# Altium schematic sheet circuitMain.SchDoc
size 420 x 297 mm; Address1: Address1; Address2: Address2; Address3: Address3; Address4: Address4; SheetNumber: 1; Scale: 1:1; Разраб.: Лепотенко А.С.; Обозначение документа: ЛАС.425683.001Э3; Т.контр.: авав; Перв. применение: ЛАС.425683.001Э3; Наименование изделия 1: Система захвата движения; Наименование изделия 2: Схема электрическая; Наименование изделия 3: принципиальная; Нач. отд.: Нач. отд.
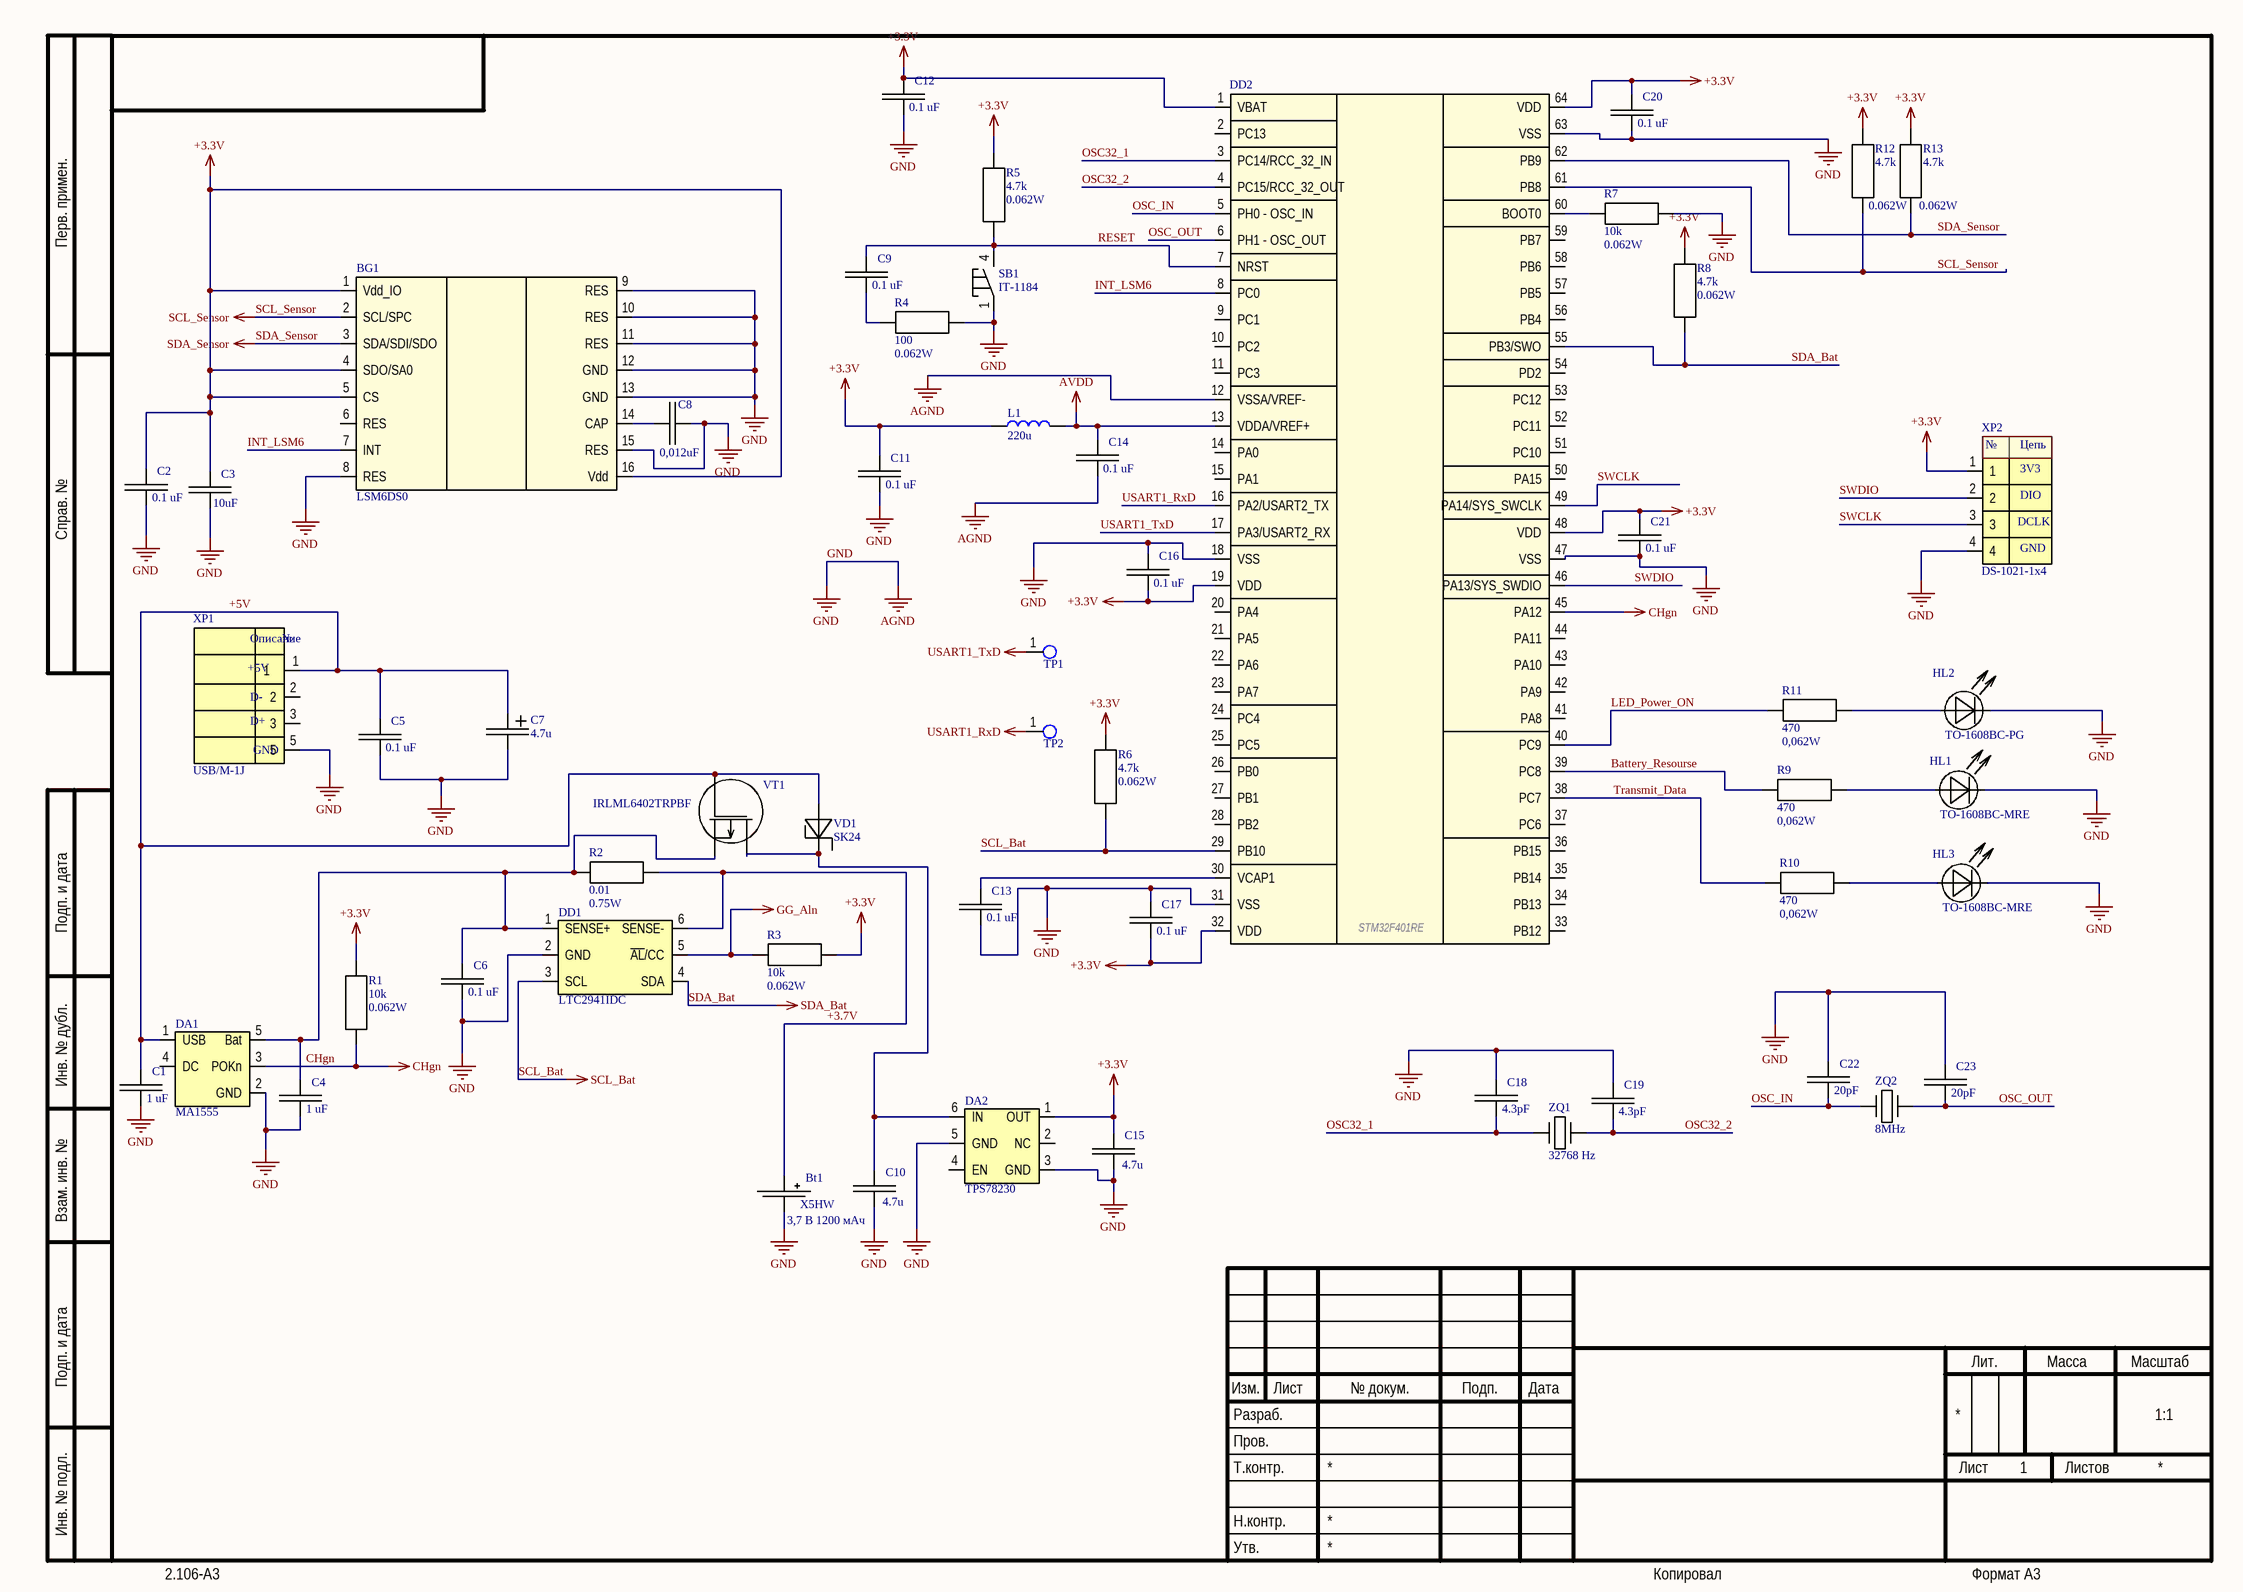
[diagram p0: circuitMain.SchDoc]

## Parts
BG1  LSM6DS0  [LGA-16]
Bt1  X5HW  value 3,7 В 1200 мАч  [X5HW]
C1  1 uF  [CAP0402_min]
C2  0.1 uF  [CAP0402_min]
C3  10uF  [CAP0402_min]
C4  1 uF  [CAP0402_min]
C5  0.1 uF  [CAP0402_min]
C6  0.1 uF  [CAP0402_min]
C7  4.7u  [Capasitor Tantal TypeA MIN]
C8  0,012uF  [CAP0402_min]
C9  0.1 uF  [CAP0402_min]
C10  4.7u  [CAP0402_min]
C11  0.1 uF  [CAP0402_min]
C12  0.1 uF  [CAP0402_min]
C13  0.1 uF  [CAP0402_min]
C14  0.1 uF  [CAP0402_min]
C15  4.7u  [CAP0402_min]
C16  0.1 uF  [CAP0402_min]
C17  0.1 uF  [CAP0402_min]
C18  4.3pF  [CAP0402_min]
C19  4.3pF  [CAP0402_min]
C20  0.1 uF  [CAP0402_min]
C21  0.1 uF  [CAP0402_min]
C22  20pF  [CAP0402_min]
C23  20pF  [CAP0402_min]
DA1  MA1555  [SOT23-5]
DA2  TPS78230  [WSON-6]
DD1  LTC2941IDC  [DFN-6]
DD2  STM32F401RE  [LQFP-64]
HL1  TO-1608BC-MRE  [LED1206]
HL2  TO-1608BC-PG  [LED1206]
HL3  TO-1608BC-MRE  [LED1206]
L1  220u  [LQG15HN15NJ]
R1  Power: 0.062W  [0402]  (hidden comment: 10k)
R2  Power: 0.75W  [1206]  (hidden comment: 0.01)
R3  Power: 0.062W  [0402]  (hidden comment: 10k)
R4  Power: 0.062W  [0402]  (hidden comment: 100)
R5  Power: 0.062W  [0402]  (hidden comment: 4.7k)
R6  Power: 0.062W  [0402]  (hidden comment: 4.7k)
R7  Power: 0.062W  [0402]  (hidden comment: 10k)
R8  Power: 0.062W  [0402]  (hidden comment: 4.7k)
R9  Power: 0,062W  [0402]  (hidden comment: 470)
R10  Power: 0,062W  [0402]  (hidden comment: 470)
R11  Power: 0,062W  [0402]  (hidden comment: 470)
R12  Power: 0.062W  [0402]  (hidden comment: 4.7k)
R13  Power: 0.062W  [0402]  (hidden comment: 4.7k)
SB1  IT-1184  [IT-1184]
TP1  TP  [TP_Hole]  (value not drawn)
TP2  TP  [TP_Hole]  (value not drawn)
VD1  SK24  [DO-214(SMB)]
VT1  IRLML6402TRPBF  [SOT23-3]
XP1  USB/M-1J  [USB/M-1J]
XP2  DS-1021-1x4  [Connector_STKLink]
ZQ1  32768 Hz  [KX-26]
ZQ2  8MHz  [SMD0503]

## Nets
+3.3V: BG1.1(Vdd_IO) BG1.4(SDO/SA0) BG1.5(CS) BG1.16(Vdd) C2.1 C3.1 C11.1 C12.1 C15.1 C16.2 C17.2 C20.1 C21.1 DA2.1(OUT) DD2.1(VBAT) DD2.19(VDD) DD2.32(VDD) DD2.48(VDD) DD2.64(VDD) L1.1 R1.2 R3.1 R5.2 R6.2 R8.2 R12.2 R13.2 XP2.1
AVDD: C14.1 DD2.13(VDDA/VREF+) L1.2
CHgn: DA1.3(POKn) DD2.45(PA12) R1.1
GG_Aln: DD1.5(~{AL}/CC) R3.2
GND: BG1.8(RES) BG1.9(RES) BG1.10(RES) BG1.11(RES) BG1.12(GND) BG1.13(GND) BG1.15(RES) Bt1.2 C1.2 C2.2 C3.2 C4.2 C5.2 C6.2 C7.2 C8.2 C10.2 C11.2 C12.2 C13.2 C14.2 C15.2 C16.1 C17.1 C18.1 C19.1 C20.2 C21.2 C22.1 C23.1 DA1.2(GND) DA2.3(GND) DA2.5(GND) DD1.2(GND) DD2.12(VSSA/VREF-) DD2.18(VSS) DD2.31(VSS) DD2.47(VSS) DD2.63(VSS) HL1.2 HL2.2 HL3.2 R4.1 R7.1 SB1.1 XP1.5 XP2.4  [also labelled AGND]
SCL_Bat: DD1.3(SCL) DD2.29(PB10) R6.1
SCL_Sensor: BG1.2(SCL/SPC) DD2.61(PB8) R12.1
SDA_Bat: DD1.4(SDA) DD2.55(PB3/SWO) R8.1
SDA_Sensor: BG1.3(SDA/SDI/SDO) DD2.62(PB9) R13.1
USART1_RxD: DD2.16(PA2/USART2_TX) TP2.1
USART1_TxD: DD2.17(PA3/USART2_RX) TP1.1
+3.7V: Bt1.1 DD1.6(SENSE-) R2.2
+5V: C1.1 C5.1 C7.1 DA1.1(USB) VD1.1 VT1.1(G) XP1.1
Battery_Resourse: DD2.39(PC8) R9.2
INT_LSM6: BG1.7(INT) DD2.8(PC0)
LED_Power_ON: DD2.40(PC9) R11.2
OSC32_1: C18.2 DD2.3(PC14/RCC_32_IN) ZQ1.1
OSC32_2: C19.2 DD2.4(PC15/RCC_32_OUT) ZQ1.3
OSC_IN: C22.2 DD2.5(PH0_-_OSC_IN) ZQ2.1
OSC_OUT: C23.2 DD2.6(PH1_-_OSC_OUT) ZQ2.3
RESET: C9.1 DD2.7(NRST) R5.1 SB1.4
SWCLK: DD2.49(PA14/SYS_SWCLK) XP2.3
SWDIO: DD2.46(PA13/SYS_SWDIO) XP2.2
Transmit_Data: DD2.38(PC7) R10.2
NetBG1_14: BG1.14(CAP) C8.1
NetC4_1: C4.1 C6.1 DA1.5(Bat) DD1.1(SENSE+) R2.1 VT1.2(Source)
NetC9_2: C9.2 R4.2
NetC10_1: C10.1 DA2.6(IN) VD1.2 VT1.3(D)
NetC13_1: C13.1 DD2.30(VCAP1)
NetDD2_60: DD2.60(BOOT0) R7.2
NetHL1_1: HL1.1 R9.1
NetHL2_1: HL2.1 R11.1
NetHL3_1: HL3.1 R10.1

Not connected (* = marked no-connect by the designer): BG1 6(RES); DA1 4(DC); DA2 2(NC) 4(EN); DD2 2(PC13) 9(PC1) 10(PC2) 11(PC3) 14(PA0) 15(PA1) 20(PA4) 21(PA5) 22(PA6) 23(PA7) 24(PC4) 25(PC5) 26(PB0) 27(PB1) 28(PB2) 33(PB12) 34(PB13) 35(PB14) 36(PB15) 37(PC6) 41(PA8) 42(PA9) 43(PA10) 44(PA11) 50(PA15) 51(PC10) 52(PC11) 53(PC12) 54(PD2) 56(PB4) 57(PB5) 58(PB6) 59(PB7); XP1 2 3

## Notes on the sheet
- Перв. примен.
- Справ. №
- Подп. и дата
- Инв. № дубл.
- Взам. инв. №
- Разраб.
- Изм.
- Лист
- № докум.
- Подп.
- Дата
- Лит.
- Масса
- Масштаб
- Пров.
- Т.контр.
- Листов
- Инв. № подл.
- Утв.
- Н.контр.
- 2.106-A3
- Копировал
- Формат А3
- (in symbol Connector_STKLink) №; Цепь; 3V3; DIO; DCLK; GND
- (in symbol USB-M-1J) Описание; №; +5V; D-; D+; GND

## Library data of the parts
BG1 = LSM6DS0: IMEMO; Manufacture: STMMicroElectronics; Value: 16g; Part Number: LSM6DS0; Package: LGA-16; Price: 4,5; Quantity: 10; ShoppingPlace: https://ru.aliexpress.com/store/product/Free-shipping-10PCS-LSM6DS0TR-LGA-16-LSM6DS0-new-chip-IC-best-quality/1749123_32483761173.html?aff_platform=link-c-tool&cpt=1531246783362&sk=ZjmAemm&aff_trace_key=8a7dd90f83b244d7b563d2b9fb293d25-1531246783362-08030-ZjmAemm&terminal_id=636778b2a25b45858895bbc6c5ce3b1a; Documentation: https://www.st.com/resource/en/datasheet/lsm6ds0.pdf
Bt1 = X5HW: Part Number: 2025; Manufacturer: china; Quantity: https://ru.aliexpress.com/item/3-7-1200-Lipo/32852574199.html?spm=a2g0v.search0604.3.181.2111fc08nULavV&ws_ab_test=searchweb0_0%2Csearchweb201602_3_10152_10151_10065_10344_10068_10342_10343_10340_10341_10696_10084_5722520_10083_5711520_10618_10307_10059_5722620_5722920_306_5722720_5722820_100031_5711420_10103_10624_10623_10622_10621_10620_10125%2Csearchweb201603_31%2CppcSwitch_5&algo_expid=a7204690-5c98-48fe-b8bb-b8922ec76835-26&algo_pvid=a7204690-5c98-48fe-b8bb-b8922ec76835&transAbTest=ae803_2&priceBeautifyAB=0; Package: smd; Price: 5; ShoppingPlace: https://ru.aliexpress.com/item/1Pcs-3-7V-800mAh-Battery-for-Drone-For-x5c-x5sw-x5-L15-RC-Quadcopter-Pro-Accessories/32853787962.html?spm=a2g0v.search0604.3.56.7e86fc08nuVnEH&ws_ab_test=searchweb0_0,searchweb201602_3_10846_10152_10065_10151_10344_10068_10342_10343_10340_10059_10341_10696_100031_10084_10083_10103_524_10618_10624_10307_10623_10622_10621_10620,searchweb201603_2,ppcSwitch_5&algo_expid=3f134381-0cd0-46b3-8018-4341e1aaa5ba-8&algo_pvid=3f134381-0cd0-46b3-8018-4341e1aaa5ba&transAbTest=ae803_2&priceBeautifyAB=0
C1 C4 = Capasitor: Part Number: GRM155R61A105KE15B; Manufacturer: Murata Manufacturing; Voltage: 10V; Value: 1 uF; Quantity: 50; Package: 0402; Price: 0,035; ShoppingPlace: https://www.ru-chipdip.by/product/grm155r61a105k
C2 C5 C6 C9 C11-C14 C16 C17 C20 C21 = Capasitor: Part Number: C1005X7R1H104KT000F; Manufacturer: TDK; Voltage: 50V; Value: 0.1 uF; Quantity: 50; Package: 0402; Price: 0,15; ShoppingPlace: http://belchip.by/product/?selected_product=33981
C3 = Capasitor: Part Number: GRM1535C1H100J; Manufacturer: Murata Manufacturing; Voltage: 50V; Value: 10uF; Quantity: 50; Package: 0402; Price: 0,02; ShoppingPlace: https://www.ru-chipdip.by/product/grm1535c1h100j
C7 = Capasitor Electrolit: Part Number: TECAP4.7/16VA10; Manufacturer: China; Power: 16V; Value: 4.7u; Price: 0.16; ShoppingPlace: https://www.ru-chipdip.by/product0/850917081; Package: Type A
C8 = Capasitor: Part Number: GRM155R71H123K; Manufacturer: Murata Manufacturing; Voltage: 50V; Value: 0,012uF; Quantity: 50; Package: 0402; Price: 0,02; ShoppingPlace: https://www.ru-chipdip.by/product/grm155r71h123k
C10 C15 = Capasitor: Part Number: GRM2165C1H4R7CD01D; Manufacturer: Murata Manufacturing; Voltage: 50V; Value: 4.7u; Quantity: 50; Package: 0402; Price: 0,035; ShoppingPlace: https://www.ru-chipdip.by/product/grm2165c1h4r7c
C18 C19 = Capasitor: Part Number: CL05C4R7BB5NNNC; Manufacturer: Samsung; Voltage: 50V; Value: 4.3pF; Quantity: 50; Package: 0402; Price: 0,15; ShoppingPlace: http://belchip.by/product/?selected_product=18863
C22 C23 = Capasitor: Part Number: CL05C220JB5NNNC; Manufacturer: Samsung; Voltage: 50V; Value: 20pF; Quantity: 50; Package: 0402; Price: 0,15; ShoppingPlace: http://belchip.by/product/?selected_product=18843
DA1 = MAX1555: Part Number: MAX1555EZK+T; Manufacturer: Maxim Integrated Products; Quantity: 1; Package: SOT-23-5; Price: 1; ShoppingPlace: http://belchip.by/product/?selected_product=06393
DA2 = TPS78230: Part Number: TSOT23-5; Manufacturer: Texas Instruments; Value: 3V; Quantity: 1; Package: SOT-23-6; Price: 1.58; ShoppingPlace: https://www.digikey.com/product-detail/en/texas-instruments/TPS78230DDCR/296-24372-2-ND/2051745
DD1 = LTC2941IDC: Manufacturer: RoHS Compliant; Value: 5V; Part Number: LTC2941IDC; Quantity: 1; Package: 6-DFN; Price: 1.58; ShoppingPlace: https://www.digikey.com/product-detail/en/linear-technology-analog-devices/LTC1754ES6-5-TRMPBF/LTC1754ES6-5-TRMPBFTR-ND/962607
DD2 = STM32F401RE: Manufacturer: STM MicroElectronics; Value: *; Documentation: http://www.keil.com/dd/docs/datashts/st/stm32f4xx/dm00102166.pdf; Price: 12; ShoppingPlace: *; Quantity: 1; Part Number: STM32F401RE
HL1 HL3 = LED: Manufacturer: Taiwan Oasis Technology Co; Value: RED; Part Number: TO-1608BC-MRE; Price: 0.03; Package: 1608; Quantity: 10; Shopping Place: https://www.ru-chipdip.by/product/to-1608bc-mre
HL2 = LED: Manufacturer: Taiwan Oasis Technology; Value: GREEN; Part Number: TO-1608BC-PG; Price: 0.03; Package: 1608; Quantity: 10; Shopping Place: https://www.ru-chipdip.by/product/to-1608bc-pg
L1 = Inductor: Part Number: CM453232-221KL; Manufacturer: Bourns; Value: 220u; ShoppingPlace: https://www.ru-chipdip.by/product/cm453232-221kl; Price: 0.225; Package: 1812; Quantity: 2
R1 R3 R7 = Resistor: Manufacturer: Тайвань; Part Number: RC0402FR-0710KL; Quntity: 50; Price: 0,015; Package: 0402; Value: 10k
R2 = Resistor: Manufacturer: China; Part Number: 120600R1; Quntity: 50; Price: 4; Package: 1206; ShoppingPlace: https://ru.aliexpress.com/item/Power-Adapter-Chip-Resistors-1206-0-01R-0-01-ohms-R010-100pcs/32834259073.html?spm=a2g0v.search0604.3.249.2a2b60c7NBGyXV&ws_ab_test=searchweb0_0,searchweb201602_3_10152_10151_10065_10344_10068_10342_10343_10340_10341_10696_10084_5722520_10083_5711520_10618_10307_10059_5722620_5722920_5722720_5722820_100031_5711420_10103_524_10624_10623_10622_10621_10620_10125,searchweb201603_6,ppcSwitch_5&algo_expid=fa6d5ed5-cdca-4e44-a6e1-815c4b4f7787-37&algo_pvid=fa6d5ed5-cdca-4e44-a6e1-815c4b4f7787&transAbTest=ae803_2&priceBeautifyAB=0; Value: 0.01
R4 = Resistor: Manufacturer: Тайвань; Part Number: RC0603FR-07100RL; Quntity: 50; Price: 0.03; Package: 0402; ShoppingPlace: https://www.ru-chipdip.by/product0/9000079616; Value: 100
R5 R6 R8 R12 R13 = Resistor: Manufacturer: Тайвань; Part Number: RC0402JR-074K7L; Quntity: 50; Price: 0.03; Package: 0402; ShoppingPlace: https://www.ru-chipdip.by/product0/9000189640; Value: 4.7k
R9-R11 = Resistor: Manufacturer: Тайвань; Part Number: RC0805FR-07470RL; Quntity: 50; Price: 0,015; Package: 0402; ShoppingPlace: https://www.ru-chipdip.by/product0/9000079478; Value: 470
SB1 = Button: Manufacturer: China; Part Number: IT-1184; Price: 2; Value: *; ShoppingPlace: https://www.chipdip.ru/product/it-1184-smd; Quantity: 5; Package: IT-1184
VD1 = Basic_Diode_shottki: Value: 2A,40V; Power: 80W; Part Number: SK24; Package: SMB; Quantity: 1; Price: 0,11; ShoppingPlace: http://belchip.by/product/?selected_product=28813; Documantation: http://belchip.by/sitedocs/28813.pdf
VT1 = IRLML6402: Manufacturer: International rectifier; Value: -20V,0,065Om; Package: SOT-23; Price: 0,17; ShoppingPlace: http://belchip.by/product/?selected_product=07913; Part Number: IRLML6402TRPBF; Quantity: 1; Documentation: https://www.infineon.com/dgdl/irlml6402pbf.pdf?fileId=5546d462533600a401535668d5c2263c
XP1 = USB-M-1J: Manufacturer: ESB; ShoppingPlace: http://belchip.by/product/?selected_product=07369; Price: 2; Value: *; Package: ESB 22 SERIES; Part Number: USB/M-1J; Quantity: 1
XP2 = Connector_STKLink: Manufacturer: Ningbo connfly electronic; Value: 100V; Part Number: DS-1021-1x4; Price: 0,09; Quantity: 10; shoppingPlace: https://www.ru-chipdip.by/product/pls-4; Package: DS-1021
ZQ1 = Rzanator: Manufacturer: CHina; Value: 32768 Hz; Part Number: KX-26; Package: KX-26; Quantity: 1; Price: 1; ShoppingPlace: http://belchip.by/product/?selected_product=18329
ZQ2 = Rzanator: Part Number: SMD0503(4P); Manufacturer: CHina; Value: 8MHz; Package: SMD0503; Quantity: 1; Price: 0.6; ShoppingPlace: https://www.ru-chipdip.by/product0/9000341671